# EAGLE design bt (EAGLE 5.11)
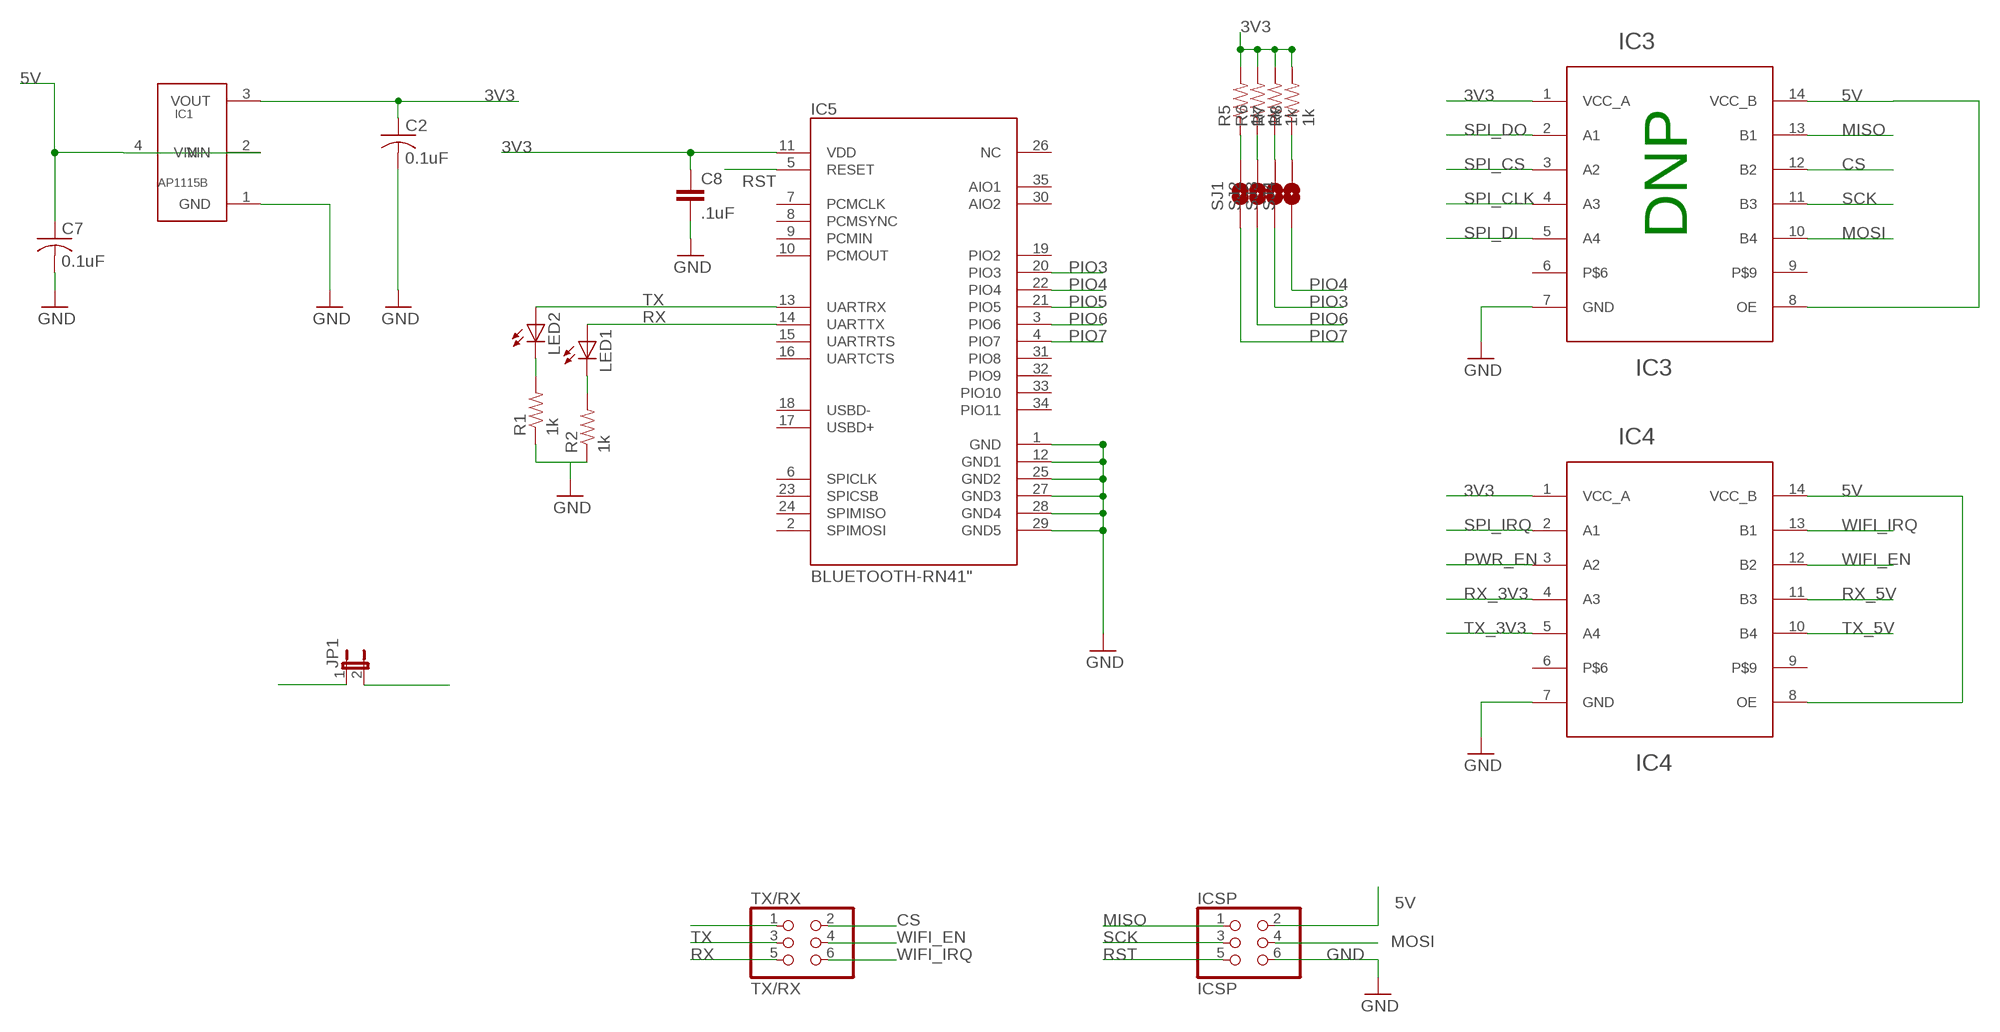
[diagram p0: schematic, sheet 1]

## Parts
C2  0.1uF  C-USC0603  [C0603]
C7  0.1uF  C-USC0603  [C0603]
C8  .1uF  CAP0805  [0805]
IC1  AP1115B  AP1115  [SOT89-3L]
IC3  TXS0104EPWR  TXS0104E  [TSSOP-14]
IC4  TXS0104EPWR  TXS0104E  [TSSOP-14]
IC5  BLUETOOTH-RN41"  [RN41]
ICSP  ICSP  PINHD-2X3  [2X03]
JP1  JUMPER-2SMD-NO  [SJ_2S-NO]
LED1  LED0603  [LED-0603]
LED2  LED0603  [LED-0603]
R1  1k  RESISTOR  [0805]
R2  1k  RESISTOR  [0805]
R5  1k  RESISTOR  [0805]
R6  1k  RESISTOR  [0805]
R7  1k  RESISTOR  [0805]
R8  1k  RESISTOR  [0805]
SJ1  SOLDERJUMPERNO  [SJ_2S-NO]
SJ2  SOLDERJUMPERNO  [SJ_2S-NO]
SJ3  SOLDERJUMPERNO  [SJ_2S-NO]
SJ4  SOLDERJUMPERNO  [SJ_2S-NO]
TX/RX  TX/RX  PINHD-2X3  [2X03]

## Nets
3V3 [power]: C2.1 C8.1 IC1.3(VOUT) IC3.1(VCC_A) IC4.1(VCC_A) IC5.11(VDD) R5.2 R6.2 R7.2 R8.2
5V [power]: C7.1 IC1.2(VIN) IC1.4(VIN) IC3.8(OE) IC3.14(VCC_B) IC4.8(OE) IC4.14(VCC_B) ICSP.2
CS: IC3.12(B2) TX/RX.2
GND: C2.2 C7.2 C8.2 IC1.1(GND) IC3.7(GND) IC4.7(GND) IC5.1(GND) IC5.12(GND1) IC5.25(GND2) IC5.27(GND3) IC5.28(GND4) IC5.29(GND5) ICSP.6 JP1.2 R1.1 R2.1
MISO: IC3.13(B1) ICSP.1
MOSI: IC3.10(B4) ICSP.4
N$1: TX/RX.1
N$2: LED2.C R1.2
N$3: LED1.C R2.2
N$5: R5.1 SJ1.2
N$21: R7.1 SJ3.2
N$23: R6.1 SJ2.2
N$24: R8.1 SJ4.2
PIO3: IC5.20(PIO3) SJ3.1
PIO4: IC5.22(PIO4) SJ4.1
PIO5: IC5.21(PIO5)
PIO6: IC5.3(PIO6) SJ2.1
PIO7: IC5.4(PIO7) SJ1.1
PWR_EN: IC4.3(A2)
RST: IC5.5(RESET) ICSP.5 JP1.1
RX: IC5.14(UARTTX) LED1.A TX/RX.5
RX_3V3: IC4.4(A3)
RX_5V: IC4.11(B3)
SCK: IC3.11(B3) ICSP.3
SPI_CLK: IC3.4(A3)
SPI_CS: IC3.3(A2)
SPI_DI: IC3.5(A4)
SPI_DO: IC3.2(A1)
SPI_IRQ: IC4.2(A1)
TX: IC5.13(UARTRX) LED2.A TX/RX.3
TX_3V3: IC4.5(A4)
TX_5V: IC4.10(B4)
WIFI_EN: IC4.12(B2) TX/RX.4
WIFI_IRQ: IC4.13(B1) TX/RX.6
Unconnected: IC3.6 IC3.9 IC4.6 IC4.9 IC5.2(SPIMOSI) IC5.6(SPICLK) IC5.7(PCMCLK) IC5.8(PCMSYNC) IC5.9(PCMIN) IC5.10(PCMOUT) IC5.15(UARTRTS) IC5.16(UARTCTS) IC5.17(USBD+) IC5.18(USBD-) IC5.19(PIO2) IC5.23(SPICSB) IC5.24(SPIMISO) IC5.26(NC) IC5.30(AIO2) IC5.31(PIO8) IC5.32(PIO9) IC5.33(PIO10) IC5.34(PIO11) IC5.35(AIO1)

## Notes on the sheet
- DNP

## Library data of the parts
C2 C7 = rcl:C-US: CAPACITOR, American symbol
C8 = SparkFun:CAP: Capacitor Standard 0603 ceramic capacitor, and 0.1" leaded capacitor.
IC1 = wifi:AP1115
IC3 IC4 = pcbqr_v3:TXS0104E
IC5 = NSL_Mini_Quad:BLUETOOTH-RN41
ICSP TX/RX = pinhead:PINHD-2X3: PIN HEADER
JP1 = SparkFun:JUMPER-2: Jumper Basic 0.1" spaced jumper. Use with breakaway headers.
LED1 LED2 = SparkFun:LED: LEDs Standard schematic elements and footprints for 5mm, 3mm, 1206, and 0603 sized LEDs. 5mm - Spark Fun Electronics SKU : COM-00529 (and others)
R1 R2 R5-R8 = SparkFun:RESISTOR: Resistor Basic schematic elements and footprints for 0603, 1206, and PTH 1/10th watt (small) resistors.
SJ1-SJ4 = SparkFun:SOLDERJUMPER: Solder Jumper Standard SMD solder jumper. Used to automate production. Two varients : Normally Open and Normally Closed are the same, but have different paste layers. NC will have a large amount of paste and should jumper during reflow.

## Net classes
1 power: width 0.203 mm

## Board
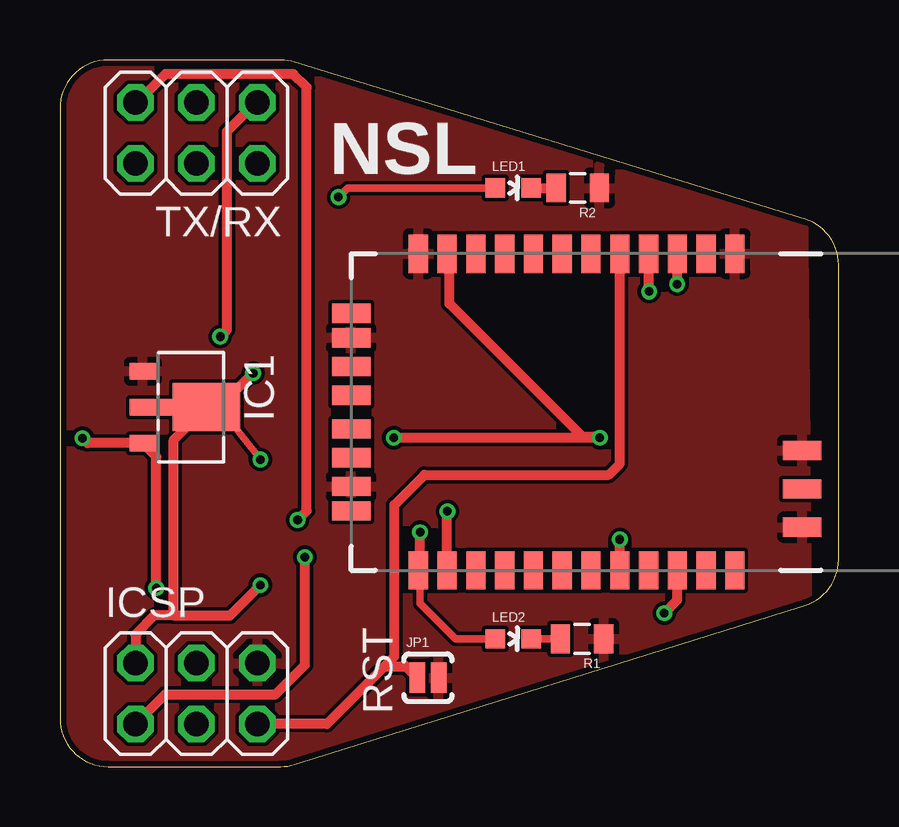
[diagram p1: board, top side]
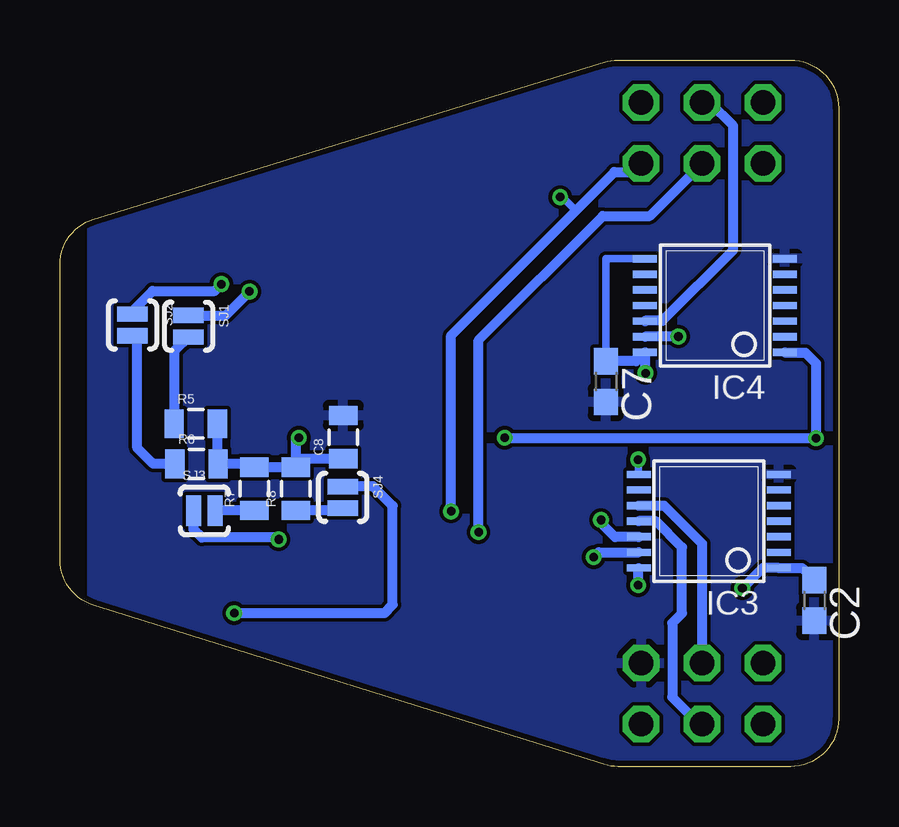
[diagram p2: board, bottom side, seen from below]

Size 32.46 x 29.46 mm. Coordinates in mm from the lower left corner, seen from the top.
Outline: 31.06,6.72 arc73 32.46,8.63 32.46,20.92 arc73 31.05,22.84 9.79,29.38 arc17 9.2,29.46 2,29.46 arc90 0,27.46 0,2 arc90 2,0 9.2,0 arc17 9.79,0.09 31.06,6.72
Copper layers (1*16): Top 0.035mm / dielectric 1.5mm / Bottom 0.035mm
Design rules "ITead_rule": minimum track width 6mil, minimum drill 12mil, track to track 6mil, track to pad 6mil, pad to pad 6mil, via to via 6mil, smd to smd 0mil, copper to edge 10mil, drill to drill 10mil, minimum pad ring 10mil, minimum via ring 6mil, stop-mask expansion 2mil, vias tented up to drill 100mil, thermal gap 10mil

### Footprints (pad centres in the part's own frame; a part is rotated, then mirrored left to right if it is on the bottom)
C0603 = smd 1.1 x 1: 1 -0.85,0; 2 0.85,0
0805 = smd 0.8 x 1.2: 1 -0.9,0; 2 0.9,0
SOT89-3L = smd 0.7 x 1.1: 1 -1.5,-1.75; 3 1.5,-1.75 | smd 0.7 x 1.8: 2 0,-1.4 | smd 2 x 2.8: 4 0,0.9
TSSOP-14 = smd 0.305 x 0.991: 1 -1.95,-2.918; 2 -1.3,-2.918; 3 -0.65,-2.918; 4 0,-2.918; 5 0.65,-2.918; 6 1.3,-2.918; 7 1.95,-2.918; 8 1.95,2.918; 9 1.3,2.918; 10 0.65,2.918; 11 0,2.918; 12 -0.65,2.918; 13 -1.3,2.918; 14 -1.95,2.918
RN41 = smd 0.8 x 1.6: 1 -6.6,-6.6; 2 -5.4,-6.6; 3 -4.2,-6.6; 4 -3,-6.6; 5 -1.8,-6.6; 6 -0.6,-6.6; 7 0.6,-6.6; 8 1.8,-6.6; 9 3,-6.6; 10 4.2,-6.6; 11 5.4,-6.6; 12 6.6,-6.6; 13 6.6,6.6; 14 5.4,6.6; 15 4.2,6.6; 16 3,6.6; 17 1.8,6.6; 18 0.6,6.6; 19 -0.6,6.6; 20 -1.8,6.6; 21 -3,6.6; 22 -4.2,6.6; 23 -5.4,6.6; 24 -6.6,6.6 | smd 1.6 x 0.8: 25 -9.4,4.8; 26 -9.4,3.2; 27 -9.4,1.6; 28 9.4,3.1; 29 9.4,-3.1; 30 9.4,-4.122; 31 9.4,-1.9; 32 9.4,-0.7; 33 9.4,0.7; 34 9.4,1.9; 35 9.4,4.122
2X03 = drill 1.016 octagon: 1 -2.54,-1.27; 2 -2.54,1.27; 3 0,-1.27; 4 0,1.27; 5 2.54,-1.27; 6 2.54,1.27
SJ_2S-NO = smd 0.635 x 1.27: 1 -0.45,0; 2 0.45,0
LED-0603 = smd 0.8 x 0.8: A 0,-0.75; C 0,0.75

### Placement (x,y rotation side)
C2  1.02,6.93 270 bottom
C7  9.7,16.05 270 bottom
C8  20.65,13.74 90 bottom
IC1  5.21,14.99 270 top
IC3  5.41,10.24 90 bottom
IC4  5.16,19.23 90 bottom
IC5  21.54,14.78 180 top
ICSP  5.69,3.05 0 top
JP1  15.34,3.71 0 top
LED1  18.9,24.13 270 top
LED2  18.9,5.33 270 top
R1  21.77,5.33 180 top
R2  21.59,24.13 180 top
R5  26.8,14.3 0 bottom
R6  26.77,12.62 0 bottom
R7  24.36,11.58 90 bottom
R8  22.63,11.58 90 bottom
SJ1  27.1,18.36 270 bottom
SJ2  29.44,18.41 270 bottom
SJ3  26.44,10.67 0 bottom
SJ4  20.68,11.23 270 bottom
TX/RX  5.69,26.42 0 top

### Tracks (layer width: path | path; a pad name or v marks a point on that pad's centre or on a via)
3V3  (via drill 0.36)
  Top 0.406: IC5.11 16.23,21.29 16.23,19.3 21.79,13.74 | 21.79,13.74 21.82,13.72 v22.5,13.72 | v4.01,7.44 4.01,12.93 IC1.3 1.14,13.49 v0.94,13.69 | 21.79,13.74 22.48,13.74 22.45,13.72 v13.92,13.72
  Bottom 0.406: v22.5,13.72 22.63,13.59 R8.2 | R8.2 R7.2 24.5,12.62 R6.2 25.9,12.65 R5.2 | C8.1 22.63,12.84 R8.2 | C2.1 1.52,8.29 IC3.1 3.17,8.29 v4.01,7.44 | IC4.1 2.21,17.25 1.37,17.25 0.94,16.81 v0.94,13.69 13.89,13.69 v13.92,13.72
5V  (via drill 0.36)
  Top 0.305: 6.63,14.99 v8.36,12.8
  Top 0.406: v8.36,7.57 7.09,6.3 4.75,6.3 | 4.75,6.3 3.94,6.3 3.15,5.51 ICSP.2 | IC1.4 IC1.2 | IC1.4 4.75,13.63 4.75,6.3 | IC1.4 6.63,14.99 v8.05,16.41
  Bottom 0.305: IC4.8 9.7,21.18 C7.1 | IC3.8 8.36,12.19 v8.36,12.8
  Bottom 0.406: IC3.14 8.36,8.26 v8.36,7.57 | C7.1 8.45,16.9 IC4.14 8.05,17.26 v8.05,16.41
CS  (via drill 0.36)
  Top 0.406: v9.91,10.29 10.29,10.67 10.29,28.32 9.73,28.88 4.39,28.88 3.2,27.69 TX/RX.2
  Bottom 0.406: IC3.12 9.32,9.58 9.91,10.16 v9.91,10.29
GND
  pour Top: 30.91,30.33 31.22,-1.45 -3.71,-1.6 -3.99,28.16 arc-90 -2,30.18
  pour Bottom: -4.06,30.81 31.14,30.63 31.14,-1.24 -4.06,-1.07
MISO  (via drill 0.36)
  Top 0.406: ICSP.1 4.37,3 8.97,3 10.21,4.24 v10.21,8.74
  Bottom 0.406: v10.21,8.74 10.01,8.94 IC3.13
MOSI
  Bottom 0.406: IC3.10 8.33,10.87 7.26,10.87 5.69,9.3 ICSP.4
N$2
  Top 0.305: 20.84,5.38 R1.2 LED2.C
N$3
  Top 0.406: LED1.C R2.2
N$5
  Bottom 0.406: SJ1.2 27.7,17.32 R5.1
N$21
  Bottom 0.406: R7.1 SJ3.2
N$23
  Bottom 0.406: SJ2.2 29.24,17.76 29.24,13.28 28.57,12.62 R6.1
N$24
  Bottom 0.406: SJ4.2 20.77,10.68 R8.1
PIO3  (via drill 0.36)
  Top 0.406: IC5.20 v23.34,9.47
  Bottom 0.406: v23.34,9.47 23.42,9.55 26.54,9.55 26.89,9.9 SJ3.1
PIO4  (via drill 0.36)
  Top 0.406: v25.2,6.4 25.74,6.94 IC5.22
  Bottom 0.406: SJ4.1 19.41,11.68 18.59,10.87 18.59,6.76 18.95,6.4 v25.2,6.4
PIO6  (via drill 0.36)
  Top 0.406: IC5.3 v25.73,20.12
  Bottom 0.406: v25.73,20.12 26.01,19.84 28.6,19.84 29.44,19 SJ2.1
PIO7  (via drill 0.36)
  Top 0.406: IC5.4 24.56,21.36 v24.56,19.81
  Bottom 0.406: v24.56,19.81 25.56,18.81 SJ1.1
RST
  Top 0.406: ICSP.5 11.13,1.78 13.54,4.19 | 13.54,4.19 13.94,4.6 13.94,10.92 15.19,12.17 22.89,12.17 23.34,12.62 IC5.5 | JP1.1 14.41,4.19 13.54,4.19
RX  (via drill 0.36)
  Top 0.305: v11.61,23.75 11.99,24.13 LED1.A
  Top 0.406: v16.15,10.64 16.14,10.63 IC5.14
  Bottom 0.305: v11.61,23.75 11.51,23.75 10.95,23.19
  Bottom 0.406: v16.15,10.64 16.15,17.98 10.95,23.19 9.35,24.79 8.59,24.79 TX/RX.5
SCK
  Bottom 0.406: IC3.11 7.62,10.24 6.53,9.14 6.53,6.4 6.93,5.99 6.93,2.9 5.82,1.78 ICSP.3
TX  (via drill 0.36)
  Top 0.305: 15.01,8.18 15.01,6.81 16.48,5.33 LED2.A
  Top 0.406: IC5.13 15.01,8.18 v15.01,9.78
  Bottom 0.406: v15.01,9.78 15.01,17.78 9.83,22.96 7.87,22.96 TX/RX.3
WIFI_EN
  Bottom 0.406: IC4.12 8.06,18.59 7.34,18.59 4.39,21.54 4.39,26.72 5.36,27.69 TX/RX.4
WIFI_IRQ  (via drill 0.36)
  Top 0.406: v6.68,17.93 6.96,18.21 6.96,26.49 8.15,27.69 TX/RX.6
  Bottom 0.406: IC4.13 v6.68,17.93

### Text on the board
tPlace: NSL | RST